# Altium schematic sheet Sheet1.SchDoc
size A4; SheetNumber: 1; SheetTotal: 1
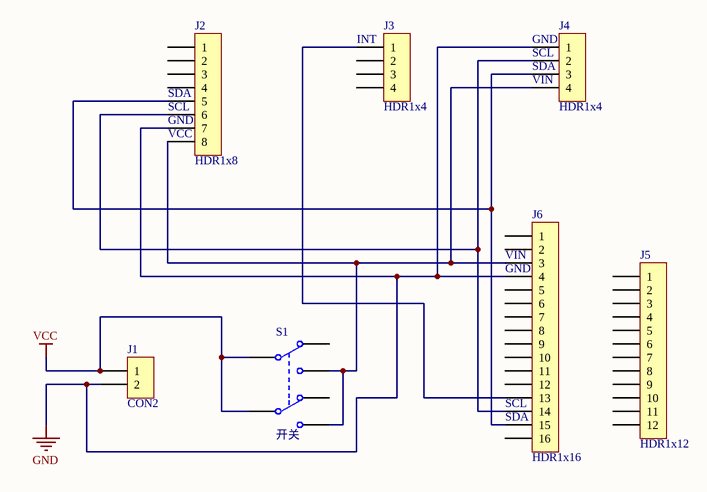
[diagram p0: Sheet1.SchDoc]

## Parts
J1  CON2  [HDR1X2]
J2  HDR1x8  [PIN-8-2.54-1.0]
J3  HDR1x4  [PIN-4-2.54-1.0]
J4  HDR1x4  [PIN-4-2.54-1.0]
J5  HDR1x12  [PIN-12-2.54-1.0]
J6  HDR1x16  [PIN-16-2.54-1.0]
S1  开关  [六角开关小]

## Nets
GND: J1.2 J2.7 J4.1 J6.4
VCC: J1.1 S1.1(COMMON1) S1.5(COMMON2)
NetJ2_5: J2.5 J4.3 J6.15
NetJ2_6: J2.6 J4.2 J6.14
NetJ2_8: J2.8 J4.4 J6.3 S1.3(NO1) S1.6(NO2)
NetJ3_1: J3.1 J6.13

Not connected (* = marked no-connect by the designer): J2 1 2 3 4; J3 2 3 4; J5 1 2 3 4 5 6 7 8 9 10 11 12; J6 1 2 5 6 7 8 9 10 11 12 16; S1 2(NC1) 4(NC2)

## Notes on the sheet
- (near J3) INT
- (near J4) GND
- (near J4) SCL
- (near J4) SDA
- (near J2) VCC
- (near J2) GND
- (near J2) SCL
- (near J2) SDA
- (near J4) VIN
- (near J6) VIN
- (near J6) GND
- (near J6) SCL
- (near J6) SDA

## Library data of the parts
J1 = CON2: Connector
J2 = HDR1x8: Connector
J3 J4 = HDR1x4: Connector
J5 = HDR1x12: Connector
J6 = HDR1x16: Connector
S1 = 六脚开关